# EasyEDA Pro project 25工创PCB.eprj, board 主控板PCB
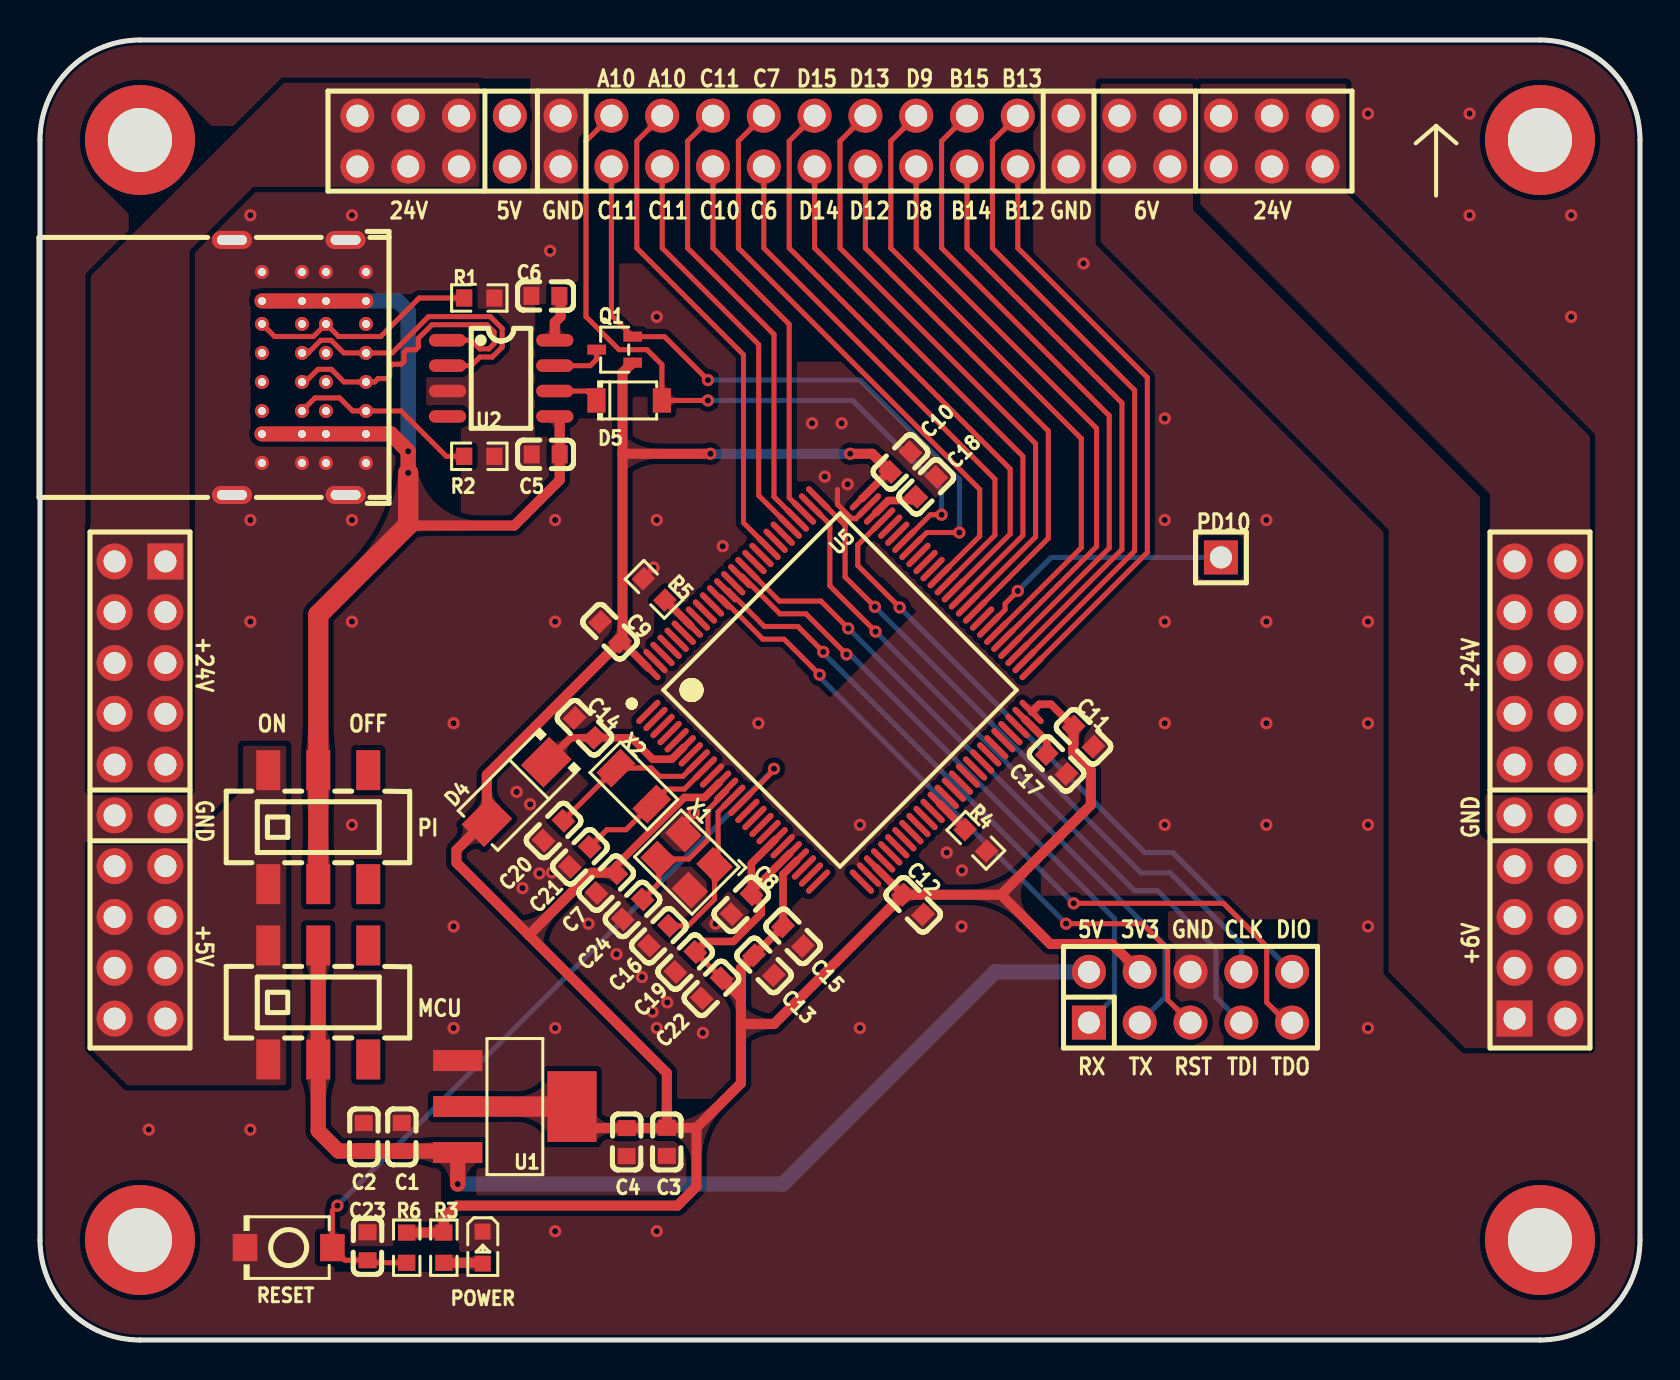
[diagram p10: board, top side]
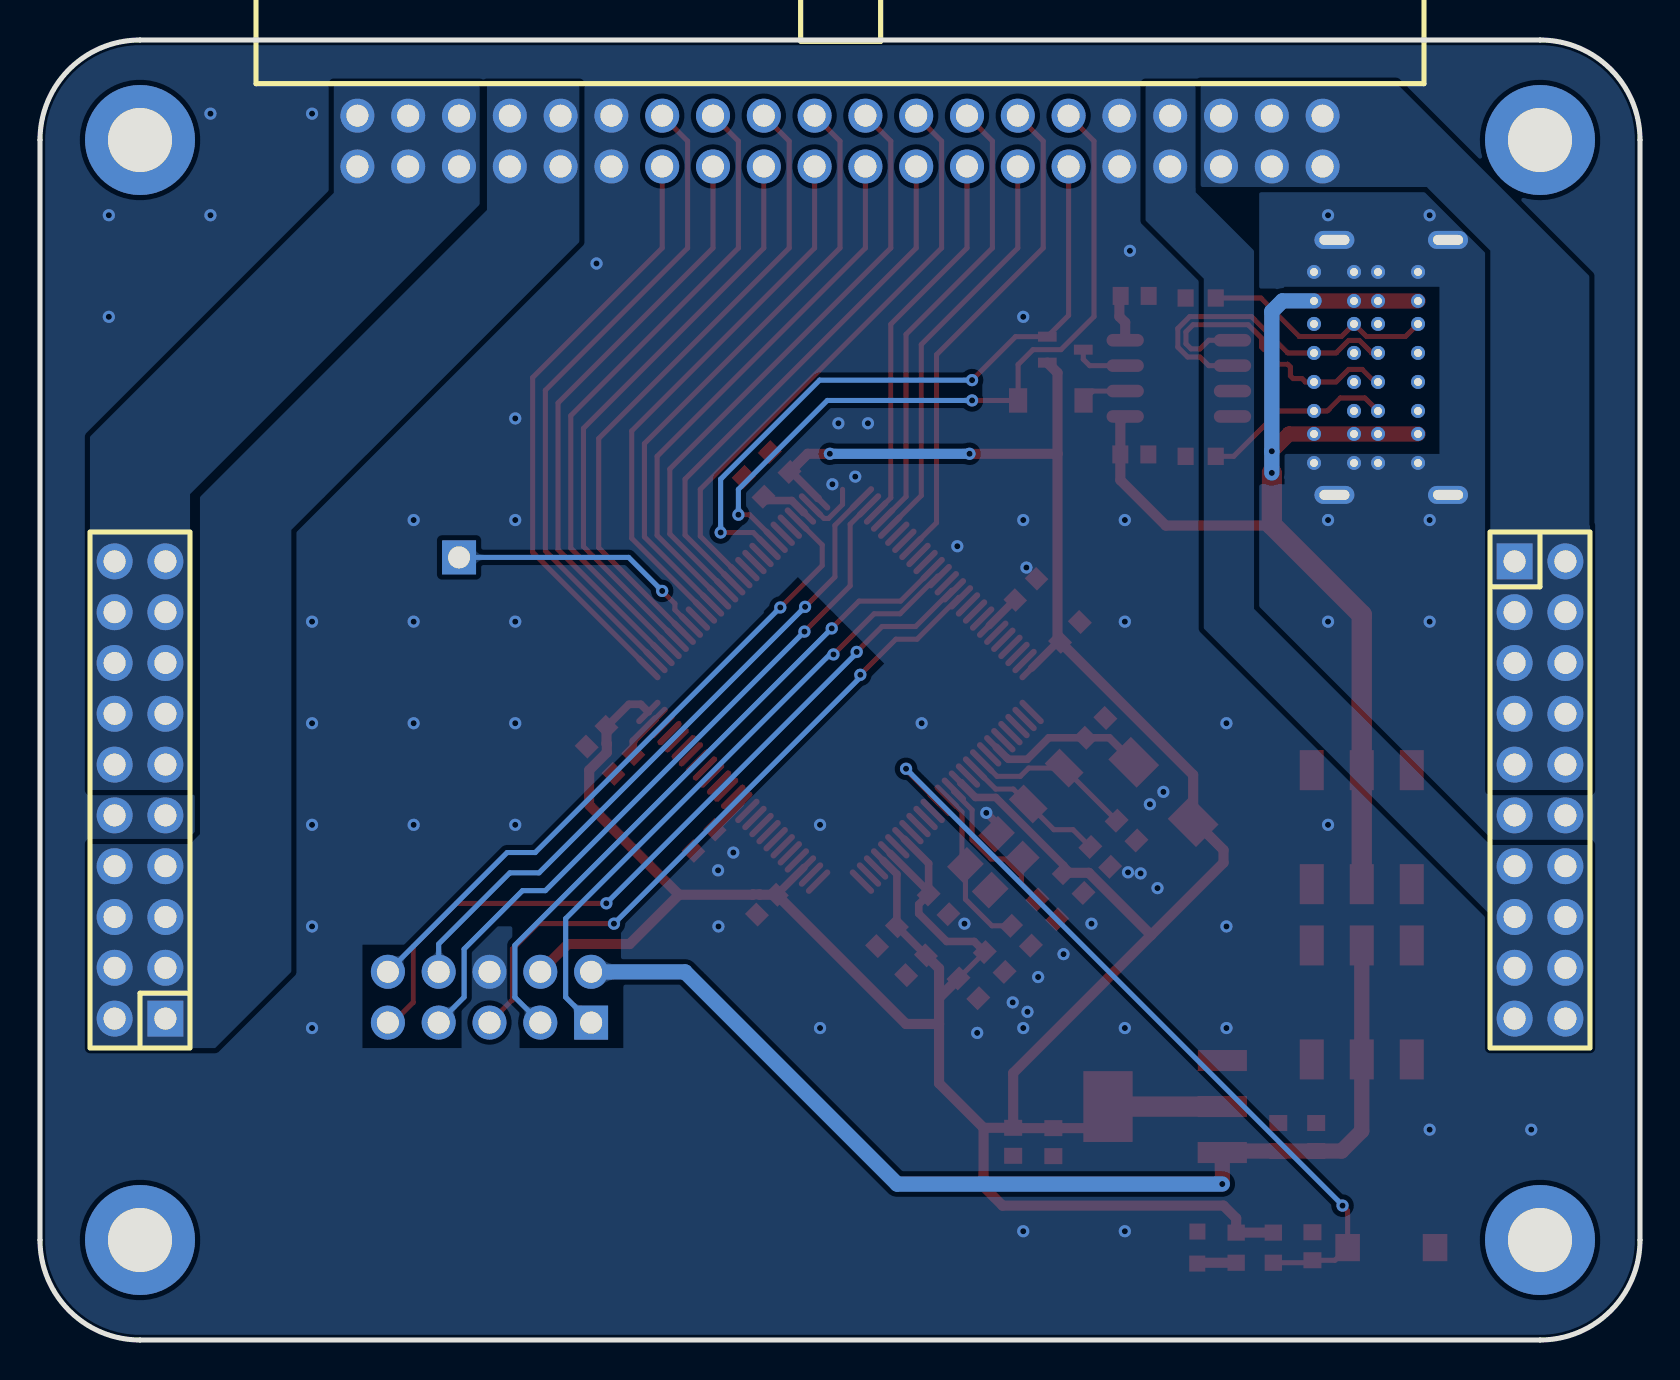
[diagram p11: board, bottom side, seen from below]

Outline 80 x 65 mm; copper layers: Top Layer, Bottom Layer. Coordinates in mm from the lower left corner of the outline.
Outline path: 0,60 0,5 arc(1.46,1.46) 5,0 75,0 arc(78.54,1.46) 80,5 80,60 arc(78.54,63.54) 75,65 5,65 arc(1.46,63.54) 0,60
Stack: Top Layer 0.035mm / Dielectric1 1.51mm FR4 er 4.5 / Bottom Layer 0.035mm

## Design rules (mm)
net USB_P: DP1
net USB_N: DP1
template: 自定义配置
spacing copperThickness1oz (default): track to track 0.102, other pairs 0.152 to 0.3
spacing copperThickness2oz: track to track 0.203, other pairs 0.152 to 0.3
track width copperThickness1oz (default): min 0.127, default 0.254, max 2.54
track width copperThickness2oz: min 0.203, default 0.254, max 2.54
differential pair differentialPair (default): width min 0.127, default 0.254, max 2.54; gap min 0.152, default 0.152
via viaSize (default): diameter min 0.5, default 0.61, max 10; hole min 0.3, default 0.305, max 6.3

## Placement (name value [footprint] x y rotation side)
C1  100nF  [C0603]  18.09 10.15 270 top
C2  100nF  [C0603]  16.19 10.15 270 top
C3  100nF  [C0603]  31.34 9.91 90 top
C4  100nF  [C0603]  29.33 9.89 270 top
C5  100nF  [C0603]  25.28 44.28 0 top
C6  100nF  [C0603]  25.27 52.2 180 top
C7  100nF  [C0603]  28.32 22.85 45 top
C8  100nF  [C0603]  35.07 21.78 45 top
C9  100nF  [C0603]  28.5 35.41 315 top
C10  100nF  [C0603]  43.02 43.9 225 top
C11  100nF  [C0603]  52.17 30.17 135 top
C12  100nF  [C0603]  43.66 21.77 135 top
C13  1uF  [C0603]  36.2 18.74 135 top
C14  100nF  [C0603]  27.23 30.61 315 top
C15  100nF  [C0603]  37.65 20.19 135 top
C16  100nF  [C0603]  30.95 20.22 45 top
C17  100nF  [C0603]  50.83 28.8 315 top
C18  100nF  [C0603]  44.32 42.66 45 top
C19  100nF  [C0603]  32.26 18.9 45 top
C20  100nF  [C0603]  25.67 25.47 225 top
C21  100nF  [C0603]  26.99 24.16 225 top
C22  1uF  [C0603]  33.58 17.58 45 top
C23  100nF  [C0603]  16.38 4.69 90 top
C24  100nF  [C0603]  29.63 21.53 45 top
CN1  B-3000R40P-0110  [IDC-TH_40P-P2.54_300R-40P]  40 59.95 0 bottom
D4  SS34  [SMA_L4.3-W2.5-LS5.0-RD]  23.83 27.4 225 top
D5  B0520W  [SOD-123_L2.7-W1.6-LS3.7-RD]  29.46 46.98 0 top
H1  PZ254V-12-10P  [HDR-TH_10P-P2.54-V-M-R2-C5-S2.54]  57.53 17.14 0 top
H2  PZ254V-11-01P  [HDR-TH_1P-P2.54-V-M]  59.05 39.13 0 top
NOREF  -  [Pad_e3]  5 60 0 top
NOREF#2  -  [Pad_e2]  75 60 0 top
NOREF#3  -  [Pad_e4]  5 5 0 top
NOREF#4  -  [Pad_e1]  75 5 0 top
POWER  Blue  [LED0603-RD]  22.13 4.62 270 top
Q1  2SK3018  [SOT-323-3_L2.0-W1.3-P1.30-LS2.1-BR]  28.74 49.52 0 top
R1  5.1K  [R0603]  21.97 52.1 0 top
R2  5.1K  [R0603]  21.97 44.18 0 top
R3  10K  [R0603]  20.19 4.62 270 top
R4  10K  [R0603]  46.79 24.98 315 top
R5  10K  [R0603]  30.7 37.53 315 top
R6  10K  [R0603]  18.34 4.62 90 top
RESET  TS-1088-AR02016  [SW-SMD_L3.9-W3.0-P4.45]  12.43 4.62 180 top
SW1  MST22D18G2 125  [SW-SMD_MST22D18G2]  13.91 16.88 0 top
SW2  MST22D18G2 125  [SW-SMD_MST22D18G2]  13.91 25.64 0 top
U1  AMS1117-3.3  [SOT-223_L6.5-W3.5-P2.30-LS7.0-BR]  23.74 11.67 180 top
U2  CH340N  [SOP-8_L4.9-W3.9-P1.27-LS6.0-BL]  23.06 48.08 270 top
U3  PM254-2-10-Z-8.5  [HDR-TH_20P-P2.54-V-F-R2-C10-S2.54]  5 27.5 270 bottom
U4  PM254-2-10-Z-8.5  [HDR-TH_20P-P2.54-V-F-R2-C10-S2.54]  75 27.5 90 bottom
U5  STM32F407VET6  [LQFP-100_L14.0-W14.0-P0.50-LS16.0-BL]  40 32.5 315 top
USB1  XUBF-0336-16B04  [USB-C-TH_XUBF-0336-16B04-1]  12.95 48.63 270 top
X1  8MHz  [OSC-SMD_4P-L3.2-W2.5-BL]  32.33 23.89 135 top
X2  32.768kHz  [crystal-smd_l3.2-w1.5_rt3215]  29.69 27.7 135 top

## Footprints (pads in the part's own frame, mm; a bottom-side part is the same pattern mirrored in y, then rotated)
C0603
  rect 0.8x0.9 smd: 1(-0.7,0) 2(0.7,0)
crystal-smd_l3.2-w1.5_rt3215
  rect 1.05x1.7 smd: 1(-1.27,0) 2(1.27,0)
HDR-TH_1P-P2.54-V-M
  rect 1.7x1.7 hole 1.1: 1(0,0)
HDR-TH_10P-P2.54-V-M-R2-C5-S2.54
  rect 1.7x1.7 hole 1.1: 1(-5.08,-1.27)
  round 1.7 hole 1.1: 2(-5.08,1.27) 3(-2.54,-1.27) 4(-2.54,1.27) 5(0,-1.27) 6(0,1.27) 7(2.54,-1.27) 8(2.54,1.27) 9(5.08,-1.27) 10(5.08,1.27)
HDR-TH_20P-P2.54-V-F-R2-C10-S2.54
  rect 1.8x1.8 hole 1.1: 1(-11.43,-1.27)
  round 1.8 hole 1.1: 2(-11.43,1.27) 3(-8.89,-1.27) 4(-8.89,1.27) 5(-6.35,-1.27) 6(-6.35,1.27) 7(-3.81,-1.27) 8(-3.81,1.27) 9(-1.27,-1.27) 10(-1.27,1.27) 11(1.27,-1.27) 12(1.27,1.27) 13(3.81,-1.27) 14(3.81,1.27) 15(6.35,-1.27) 16(6.35,1.27) 17(8.89,-1.27) 18(8.89,1.27) 19(11.43,-1.27) 20(11.43,1.27)
IDC-TH_40P-P2.54_300R-40P
  round 1.7 hole 1.1: 1(24.13,1.27) 2(24.13,-1.27) 3(21.59,1.27) 4(21.59,-1.27) 5(19.05,1.27) 6(19.05,-1.27) 7(16.51,1.27) 8(16.51,-1.27) 9(13.97,1.27) 10(13.97,-1.27) 11(11.43,1.27) 12(11.43,-1.27) 13(8.89,1.27) 14(8.89,-1.27) 15(6.35,1.27) 16(6.35,-1.27) 17(3.81,1.27) 18(3.81,-1.27) 19(1.27,1.27) 20(1.27,-1.27) 21(-1.27,1.27) 22(-1.27,-1.27) 23(-3.81,1.27) 24(-3.81,-1.27) 25(-6.35,1.27) 26(-6.35,-1.27) 27(-8.89,1.27) 28(-8.89,-1.27) 29(-11.43,1.27) 30(-11.43,-1.27) 31(-13.97,1.27) 32(-13.97,-1.27) 33(-16.51,1.27) 34(-16.51,-1.27) 35(-19.05,1.27) 36(-19.05,-1.27) 37(-21.59,1.27) 38(-21.59,-1.27) 39(-24.13,1.27) 40(-24.13,-1.27)
LED0603-RD
  rect 0.8x0.8 smd: 1(-0.799,-0.004) 2(0.799,0.004)
LQFP-100_L14.0-W14.0-P0.50-LS16.0-BL
  oval 0.3x1.6 smd: 1(-6,-7.55) 2(-5.5,-7.55) 3(-5,-7.55) 4(-4.5,-7.55) 5(-4,-7.55) 6(-3.5,-7.55) 7(-3,-7.55) 8(-2.5,-7.55) 9(-2,-7.55) 10(-1.5,-7.55) 11(-1,-7.55) 12(-0.5,-7.55) 13(0,-7.55) 14(0.5,-7.55) 15(1,-7.55) 16(1.5,-7.55) 17(2,-7.55) 18(2.5,-7.55) 19(3,-7.55) 20(3.5,-7.55) 21(4,-7.55) 22(4.5,-7.55) 23(5,-7.55) 24(5.5,-7.55) 25(6,-7.55) 51(6,7.55) 52(5.5,7.55) 53(5,7.55) 54(4.5,7.55) 55(4,7.55) 56(3.5,7.55) 57(3,7.55) 58(2.5,7.55) 59(2,7.55) 60(1.5,7.55) 61(1,7.55) 62(0.5,7.55) 63(0,7.55) 64(-0.5,7.55) 65(-1,7.55) 66(-1.5,7.55) 67(-2,7.55) 68(-2.5,7.55) 69(-3,7.55) 70(-3.5,7.55) 71(-4,7.55) 72(-4.5,7.55) 73(-5,7.55) 74(-5.5,7.55) 75(-6,7.55)
  oval 1.6x0.3 smd: 26(7.55,-6) 27(7.55,-5.5) 28(7.55,-5) 29(7.55,-4.5) 30(7.55,-4) 31(7.55,-3.5) 32(7.55,-3) 33(7.55,-2.5) 34(7.55,-2) 35(7.55,-1.5) 36(7.55,-1) 37(7.55,-0.5) 38(7.55,0) 39(7.55,0.5) 40(7.55,1) 41(7.55,1.5) 42(7.55,2) 43(7.55,2.5) 44(7.55,3) 45(7.55,3.5) 46(7.55,4) 47(7.55,4.5) 48(7.55,5) 49(7.55,5.5) 50(7.55,6) 76(-7.55,6) 77(-7.55,5.5) 78(-7.55,5) 79(-7.55,4.5) 80(-7.55,4) 81(-7.55,3.5) 82(-7.55,3) 83(-7.55,2.5) 84(-7.55,2) 85(-7.55,1.5) 86(-7.55,1) 87(-7.55,0.5) 88(-7.55,0) 89(-7.55,-0.5) 90(-7.55,-1) 91(-7.55,-1.5) 92(-7.55,-2) 93(-7.55,-2.5) 94(-7.55,-3) 95(-7.55,-3.5) 96(-7.55,-4) 97(-7.55,-4.5) 98(-7.55,-5) 99(-7.55,-5.5) 100(-7.55,-6)
OSC-SMD_4P-L3.2-W2.5-BL
  rect 1.4x1.2 smd: 1(-1.1,-0.875) 2(1.1,-0.875) 3(1.1,0.875) 4(-1.1,0.875)
Pad_e1
  round 5.5 hole 3.2: 101(0,0)
Pad_e2
  round 5.5 hole 3.2: 101(0,0)
Pad_e3
  round 5.5 hole 3.2: 101(0,0)
Pad_e4
  round 5.5 hole 3.2: 101(0,0)
R0603
  rect 0.806x0.864 smd: 1(-0.753,0) 2(0.753,0)
SMA_L4.3-W2.5-LS5.0-RD
  rect 2x1.593 smd: 1(-2.1,0) 2(2.1,0)
SOD-123_L2.7-W1.6-LS3.7-RD
  rect 0.91x1.22 smd: 1(-1.635,0) 2(1.635,0)
SOP-8_L4.9-W3.9-P1.27-LS6.0-BL
  oval 0.63x1.865 smd: 1(-1.905,-2.683) 2(-0.635,-2.683) 3(0.635,-2.683) 4(1.905,-2.683) 5(1.905,2.683) 6(0.635,2.683) 7(-0.635,2.683) 8(-1.905,2.683)
SOT-223_L6.5-W3.5-P2.30-LS7.0-BR
  rect 2.465x1.05 smd: 1(2.857,-2.3) 2(2.857,0) 3(2.857,2.3)
  rect 2.465x3.54 smd: 4(-2.857,0)
SOT-323-3_L2.0-W1.3-P1.30-LS2.1-BR
  rect 0.936x0.5 smd: 1(0.898,-0.65) 2(0.898,0.65) 3(-0.898,0)
SW-SMD_L3.9-W3.0-P4.45
  rect 1.23x1.36 smd: 1(-2.185,0) 2(2.185,0)
SW-SMD_MST22D18G2
  rect 1.2x2 smd: 1(-2.5,2.85) 2(0,2.85) 3(2.5,2.85) 4(-2.5,-2.85) 5(0,-2.85) 6(2.5,-2.85)
USB-C-TH_XUBF-0336-16B04-1
  oval 0.9x2 hole 0.5x1.5: 1(-6.375,2.33) 1(-6.375,-3.35) 1(6.375,2.33) 1(6.375,-3.35)
  round 0.7 hole 0.4: A1(-4.775,1.35) A1(-4.775,-1.85) A4(-3.325,1.35) A4(-3.325,-1.85) A5(-2.175,1.35) A5(-2.175,-1.85) A6(-0.725,1.35) A6(-0.725,-1.85) A7(0.725,1.35) A7(0.725,-1.85) A8(2.175,1.35) A8(2.175,-1.85) A9(3.325,1.35) A9(3.325,-1.85) A12(4.775,1.35) A12(4.775,-1.85) B1(4.775,3.35) B1(4.775,0.15) B4(3.325,3.35) B4(3.325,0.15) B5(2.175,3.35) B5(2.175,0.15) B6(0.725,3.35) B6(0.725,0.15) B7(-0.725,3.35) B7(-0.725,0.15) B8(-2.175,3.35) B8(-2.175,0.15) B9(-3.325,3.35) B9(-3.325,0.15) B12(-4.775,3.35) B12(-4.775,0.15)

## Nets
As in the schematic.

Pads without a net: NOREF 101; NOREF#2 101; NOREF#3 101; NOREF#4 101; SW1 3 6; SW2 3 6; U2 4; U5 1 2 3 4 5 7 15 16 17 18 23 24 25 26 29 30 31 32 33 34 35 36 38 39 40 41 42 43 44 45 46 47 48 58 65 66 67 70 71 81 82 84 85 88 91 92 93 95 96 97 98; USB1 A6 A7 A8 B8

## Via types
v1: diameter 0.61, hole 0.305, Top Layer to Bottom Layer, 87 vias

## Routing (per net, layer and track width the routed paths; a pad name or vN(x,y) marks a point on that pad's centre or on a via; arc(x,y) is an arc through that point)
+3V3: length 177.6
  Top Layer w0.254: C19.2 34.08,18.08
  Top Layer w0.381: C7.2 28.81,23.73 32.21,27.13 33.22,27.13 33.95,27.86 U5.11 ; 49.58,31.4 49.96,31.78 50.55,31.78 51.68,30.66 ; U5.19 35.57,23.83 35.57,22.41 ; 35.7,19.23 C15.2 37.15,23.29 U5.22 ; 35.57,22.41 35.57,22.28 36.06,21.78 36.06,21.32 34.67,19.93 33.29,19.93 C19.2 ; 35.57,22.41 U5.21 ; 30.42,33.6 29.1,34.91 C9.2 ; C10.2 42.43,43.4 41.11,42.08 41.1,42.08 ; 43.16,22.27 U5.28
  Top Layer w0.508: H1.4 53.6,19.8 50.51,19.8 48.05,22.26 ; 24.44,20.24 20.82,23.86 20.82,24.5 22.24,25.92 22.34,25.92 22.34,28.26 C9.2 29.12,35.04 29.12,44.31 ; 24.44,20.24 31.34,13.34 C3.2 ; 24.44,20.24 27.56,23.36 28.8,23.36 C7.2 ; C3.2 31.33,10.59 C4.1 27.68,10.59 U1.4 ; C3.2 32.82,10.61 ; Q1.1 29.12,48.36 29.12,44.31 ; 48.05,22.26 44.37,22.26 44.35,22.28 44.02,22.28 44,22.26 C12.2 36.7,15.8 35.05,15.8 ; 48.05,22.26 52.54,26.75 52.54,28.49 51.66,29.37 51.66,29.8 51.68,29.82 51.68,30.66 ; v1(40.51,44.31) 41.61,44.31 C10.2 ; 29.12,44.31 v1(33.52,44.31) ; 18.34,5.37 20.19,5.37 20.19,6.09 20.82,6.72 31.87,6.72 32.82,7.67 32.82,10.61 ; 35.05,15.8 35.05,12.83 32.82,10.61 ; 35.05,15.8 35.05,17.11 ; 35.7,19.23 35.05,18.58 35.05,17.11 ; 35.05,17.11 34.08,18.08
  Top Layer w1.016: U1.2 U1.4
  Bottom Layer w0.508: v1(33.52,44.31) v1(40.51,44.31)
+5V_MCU: length 54.2
  Top Layer w0.762: v1(20.89,7.8) U1.3 20.81,9.45 C1.2 C2.2 14.92,9.45 13.91,10.46 SW1.5 SW1.2
  Bottom Layer w0.762: H1.2 52.44,18.4 47.75,18.4 37.14,7.8 v1(20.89,7.8)
+5V_PI: length 58.6
  Top Layer w0.508: 18.41,40.75 18.44,40.72 23.71,40.72 25.98,43 25.98,45.94 U2.5
  Top Layer w0.762: USB1.A4 USB1.B9 16.3,51.95 ; USB1.A9 USB1.B4 17.54,45.3 v1(18.41,44.44) v1(18.41,43.35)
  Top Layer w1.016: SW2.5 SW2.2 13.91,36.26 18.41,40.75 v1(18.41,43.35)
  Bottom Layer w0.762: v1(18.41,43.35) v1(18.41,44.44) 18.41,51.42 17.88,51.95 16.3,51.95
GND: length 4.2
  Top Layer w0.254: 39.87,42.53 39.87,41.78 40.57,41.08 40.8,41.08 U5.74
  Top Layer w0.381: X1.2 32.17,25.84 v1(32.69,26.36)
  vias: v1(5.44,10.52) v1(10.52,56.24) v1(10.52,41) v1(10.52,35.92) v1(10.52,10.52) v1(15.6,56.24) v1(15.6,41) v1(15.6,35.92) v1(15.6,25.76) v1(20.68,30.84) v1(20.68,20.68) v1(20.68,15.6) v1(23.83,27.41) v1(24.12,22.59) v1(24.51,26.78) v1(24.97,23.33) v1(25.5,54.46) v1(25.6,23.38) v1(25.76,41) v1(25.76,35.92) v1(25.76,15.6) v1(25.76,5.44) v1(27.43,20.82) v1(28.82,19.29) v1(30.09,18.15) v1(30.63,16.41) v1(30.68,38.62) v1(30.84,51.16) v1(30.84,41) v1(30.84,15.6) v1(30.84,5.44) v1(31.36,16.88) v1(33.14,15.36) v1(33.78,20.82) v1(34.13,39.69) v1(35.92,30.84) v1(38.6,45.83) v1(39.24,43.17) v1(40.08,45.83) v1(40.38,42.79) v1(41,25.76) v1(41,15.6) v1(45.33,24.37) v1(46.1,23.48) v1(46.08,20.68) v1(52.17,53.83) v1(56.24,46.08) v1(56.24,41) v1(56.24,35.92) v1(56.24,30.84) v1(56.24,25.76) v1(61.32,41) v1(61.32,35.92) v1(61.32,30.84) v1(61.32,25.76) v1(66.4,61.32) v1(66.4,35.92) v1(66.4,30.84) v1(66.4,25.76) v1(66.4,20.68) v1(66.4,15.6) v1(71.48,61.32) v1(71.48,56.24) v1(76.56,56.24) v1(76.56,51.16)
PA13(DIO): length 33
  Top Layer w0.254: U5.72 40.89,39.75 40.89,38.72 v1(42.98,36.63)
  Bottom Layer w0.254: v1(42.98,36.63) 55.24,24.37 56.64,24.37 H1.10
PA14(CLK): length 33.3
  Top Layer w0.254: 38.9,42.08 40.25,40.73 40.25,38.15 v1(41.75,36.66)
  Bottom Layer w0.254: H1.8 60.07,19.8 56.51,23.36 55.05,23.36 v1(41.75,36.66)
PA15(TDI): length 35.4
  Top Layer w0.254: U5.77 39.49,40.79 39.49,37.71 v1(41.78,35.42)
  Bottom Layer w0.254: H1.7 58.8,17.14 58.8,19.55 55.88,22.47 54.73,22.47 v1(41.78,35.42)
PB3(TDO): length 38.9
  Top Layer w0.254: 34.31,37.48 34.41,37.48 36.22,35.67 37.9,35.67 v1(39.17,34.41) ; v1(51.68,21.83) 59.18,21.83 61.34,19.67 61.34,16.88 62.34,15.87 H1.9
  Bottom Layer w0.254: v1(39.17,34.41) 39.17,34.35 v1(51.68,21.83)
PB4(RST): length 33.9
  Top Layer w0.254: v1(51.3,20.82) 55.11,20.82 56.38,19.55 56.38,17.01 57.52,15.87 H1.5 ; v1(38.98,33.26) 37.21,35.04 36.15,35.04 34.06,37.13 U5.90
  Bottom Layer w0.254: v1(51.3,20.82) 38.98,33.14 v1(38.98,33.26)
PB12: length 30.2
  Top Layer w0.254: 49.58,33.6 55.37,39.38 55.37,48.12 48.89,54.6 CN1.13
PB13: length 33
  Top Layer w0.254: CN1.14 47.62,59.95 47.62,54.6 54.73,47.49 54.73,39.45 U5.52
PB14: length 29.7
  Top Layer w0.254: CN1.15 46.35,54.6 54.1,46.85 54.1,39.53 U5.53
PB15: length 32.6
  Top Layer w0.254: CN1.16 45.08,59.95 45.08,54.6 53.46,46.22 53.46,39.6 U5.54
PC14: length 8.3
  Top Layer w0.254: C20.1 26.17,25.97 28.79,28.6 30.57,28.6 30.98,28.18 32.15,28.18 U5.8
PC15: length 7.4
  Top Layer w0.254: U5.9 32.22,27.55 31.34,27.55 X2.1 29.3,25.52 28.35,25.52 C21.1
PH0: length 8.1
  Top Layer w0.254: C24.2 30.93,22.83 30.93,24.05 32.44,24.05 33.4,25.01 33.4,26.5 34.31,27.41 34.31,27.52
PH1: length 8.3
  Top Layer w0.254: U5.13 33.9,26.4 33.9,23.91 X1.1 33.73,22.04 32.4,20.71 C16.2
SERVO_PWM1: length 27.6
  Top Layer w0.254: U5.59 50.41,40.09 50.41,45.45 41.27,54.6 CN1.19
SERVO_PWM2: length 30.4
  Top Layer w0.254: CN1.20 40,59.95 40,54.6 49.78,44.82 49.78,40.16 U5.60
SERVO_PWM3: length 27.1
  Top Layer w0.254: CN1.21 38.73,54.6 49.14,44.18 49.14,40.23 U5.61
SERVO_PWM4: length 30
  Top Layer w0.254: 45.69,37.48 48.51,40.3 48.51,43.55 37.46,54.6 37.46,59.95 CN1.22
UART4_RX: length 23
  Top Layer w0.254: U5.79 36.7,42.17 36.7,50.28 32.38,54.6 32.38,59.95 CN1.26
UART4_TX: length 19.2
  Top Layer w0.254: U5.78 37.46,42.11 37.46,50.79 33.65,54.6 CN1.25
UART5_RX: length 24.9
  Top Layer w0.254: CN1.28 29.84,59.95 29.84,54.6 35.17,49.26 35.17,40.86 U5.83
UART5_TX: length 20.7
  Top Layer w0.254: U5.80 35.94,42.22 35.94,49.77 31.11,54.6 CN1.27
USART1_RX: length 2.3
  Top Layer w0.254: U2.6 27.35,47.45 D5.1
USART1_RX_MCU: length 36.7
  Top Layer w0.254: v1(45.08,41.26) 44.52,41.26 U5.69 ; CN1.30 27.3,59.95 27.3,51.17 28.95,49.52 30.35,49.52 31.09,48.77 D5.2 v1(33.4,46.98)
  Bottom Layer w0.254: v1(33.4,46.98) 40.63,46.98 45.08,42.53 v1(45.08,41.26)
USART1_TX: length 2.7
  Top Layer w0.254: 27.84,49.52 27.84,49.04 27.52,48.72 U2.7
USART1_TX_MCU: length 33.6
  Top Layer w0.254: v1(33.4,47.99) 31.22,50.17 Q1.2 28.57,51.23 CN1.29 ; v1(45.97,40.37) 44.34,40.37 U5.68
  Bottom Layer w0.254: v1(33.4,47.99) 41.02,47.99 45.97,43.04 v1(45.97,40.37)
USART2_RX: length 31.5
  Top Layer w0.254: 35.01,38.19 35.12,38.19 37,36.31 38.29,36.31 v1(40.33,34.28)
  Bottom Layer w0.254: v1(40.33,34.28) 40.51,34.28 53.72,21.07 53.72,17.14 H1.1
USART2_TX: length 33.1
  Top Layer w0.254: U5.86 36.97,36.94 39.05,36.94 v1(40.41,35.58)
  Bottom Layer w0.254: H1.3 56.26,17.14 56.26,19.74 v1(40.41,35.58)
USART3_RX: length 32.1
  Top Layer w0.254: U5.56 52.06,39.61 52.06,45.07 42.54,54.6 42.54,59.95 CN1.18
USART3_TX: length 29.3
  Top Layer w0.254: CN1.17 43.81,54.6 52.83,45.58 52.83,39.67 U5.55
USART6_RX: length 29.4
  Top Layer w0.254: CN1.24 34.92,59.95 34.92,54.6 46.99,42.53 46.99,40.19 44.99,38.19
USART6_TX: length 26.6
  Top Layer w0.254: CN1.23 36.19,54.6 47.75,43.04 47.75,40.25 U5.63
USB_N: length 15.6
  Top Layer w0.254: USB1.B7 13.41,49.35 14.04,49.98 14.56,49.98 15.19,49.35 17.61,49.35 19.43,51.17 22.51,51.17 23.11,50.58 23.11,49.64 22.61,49.15 21.99,49.15 21.56,48.72 U2.2
USB_P: length 15.4
  Top Layer w0.254: USB1.B6 13.27,47.9 13.9,48.53 14.57,48.53 15.2,47.9 16.73,47.9 16.9,48.07 17.34,48.07 17.48,48.21 17.48,48.65 17.62,48.79 18.06,48.79 18.2,48.93 18.2,49.37 18.34,49.51 18.78,49.51 18.92,49.64 18.92,50.09 19.59,50.76 22.35,50.76 22.7,50.41 22.7,49.81 22.45,49.56 21.99,49.56 21.56,49.99 U2.1
$1N1713: length 39.6
  Top Layer w0.254: v1(36.7,28.56) 36.7,28.49 35.01,26.81 ; v1(14.87,6.72) 14.62,6.47 14.62,4.62 15.25,3.99 C23.1 16.5,3.86 R6.1
  Bottom Layer w0.254: v1(36.7,28.56) 14.87,6.74 v1(14.87,6.72)
$1N1715: length 2.3
  Top Layer w0.381: U5.73 41.81,41.37 42.41,41.97 43.63,41.97 43.82,42.17
$1N1716: length 2.2
  Top Layer w0.381: U5.49 50.34,29.94 C17.1
$1N1732: length 8.1
  Top Layer w0.381: U5.6 31.65,29.1 31.64,29.1 31.58,29.04 30.64,29.04 29.56,30.11 C14.2 26.54,30.11 25.31,28.89
$1N1733: length 1.8
  Top Layer w0.381: R5.2 31.26,37 U5.94
$1N1744: length 1.8
  Top Layer w0.381: R4.1 46.26,25.53 44.99,26.81
$1N6023: length 2
  Top Layer w0.508: R3.2 22.09,3.86 POWER.2
$1N7609: length 2.4
  Top Layer w0.508: C6.1 26.03,52.14 26.03,51.17 25.74,50.88 U2.8
$1N10157: length 11.7
  Top Layer w0.254: USB1.A5 11.73,50.17 13.67,50.17 14.3,50.8 14.93,50.17 17.03,50.17 18.96,52.1 R1.1
$1N10439: length 9.6
  Top Layer w0.254: USB1.B5 13.75,47.11 14.98,47.11 15.63,46.45 18.04,46.45 20.31,44.18 R2.1
$1N12945: length 13.2
  Top Layer w0.254: U5.57 48.25,36.51 48.25,36.82 v1(48.89,37.45)
  Bottom Layer w0.254: v1(48.89,37.45) 50.57,39.13 H2.1

## Copper pours and planes (outline as drawn; the poured copper is in the pictures)
24V_1 on Top Layer: 2.5,27.5 2.5,40.72 2.53,40.75 2.53,53.2 12.2,62.86 21.97,62.86 21.97,57.65 10.66,57.65 7.49,54.47 7.49,27.5
24V_1 on Bottom Layer: 2.5,27.5 2.5,40.72 2.53,40.75 2.53,53.2 12.2,62.86 21.97,62.86 21.97,57.65 10.66,57.65 7.49,54.47 7.49,27.5
24V_2 on Top Layer: 72.5,42.29 58.02,56.77 58.02,62.82 65.31,62.82 65.31,57.35 77.5,45.17 77.5,27.5 72.5,27.5
24V_2 on Bottom Layer: 72.5,42.29 58.02,56.77 58.02,62.82 65.31,62.82 65.31,57.35 77.5,45.17 77.5,27.5 72.5,27.5
+5V on Top Layer: 2.5,24.75 7.36,24.75 10.16,27.55 10.16,29.71 12.31,29.71 12.31,12.74 4.36,12.74 2.5,14.6
+5V on Bottom Layer: 2.5,24.75 7.49,24.75 19.3,36.56 19.3,54.47 22.22,57.39 22.22,62.82 24.72,62.82 24.72,55.97 21.81,53.06 21.81,35.58 7.5,21.26 7.5,14.6 2.5,14.6
+6V on Top Layer: 77.5,24.8 72.5,24.8 72,25.29 72,42.15 57.65,56.5 57.65,62.82 53.03,62.82 53.03,54.9 67.43,40.5 67.43,18.4 71.24,14.59 77.5,14.59
+6V on Bottom Layer: 77.5,24.8 72.5,24.8 72,25.29 72,42.15 57.65,56.5 57.65,62.82 53.03,62.82 53.03,54.9 67.43,40.5 67.43,18.4 71.24,14.59 77.5,14.59
GND on Top Layer: -2.42,68.31 81.66,68.31 81.66,-2.68 -2.42,-2.68
GND on Bottom Layer: -4.45,71.87 85.59,71.87 85.59,-5.47 -4.45,-5.47

Small or netless copper shapes (teardrops, artwork), in the pictures only: 152 on Top Layer, 25 on Bottom Layer

## Text on the board
Top Silkscreen Layer: +24V | GND | +6V | +5V | ON | OFF | PI | MCU | A10 | C11 | C10 | C6 | C7 | D15 | D14 | D13 | D12 | D8 | D9 | B15 | B14 | B13 | B12 | 5V | RX | 3V3 | TX | 6V | RST | PD10 | CLK | TDI | 24V | TDO | DIO | →
